# EAGLE design Serial Boy (EAGLE 9.0.0)
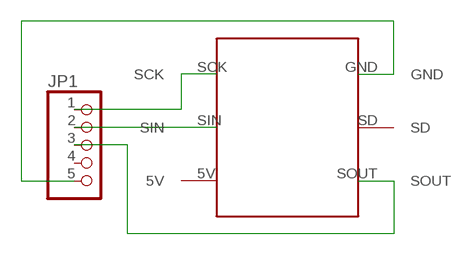
[diagram p0: schematic, sheet 1]

## Parts
JP1  PINHD-1X5/90  [1X05/90]
LNK  CARDEDGE  [CARDEDGE]

## Nets
GND: JP1.5 LNK.GND
SCK: JP1.1 LNK.SCK
SIN: JP1.2 LNK.SIN
SOUT: JP1.3 LNK.SOUT
Unconnected: JP1.4 LNK.5V LNK.SD

## Library data of the parts
JP1 = pinhead:PINHD-1X5: PIN HEADER
LNK = Card Edge:CARDEDGE

## Board
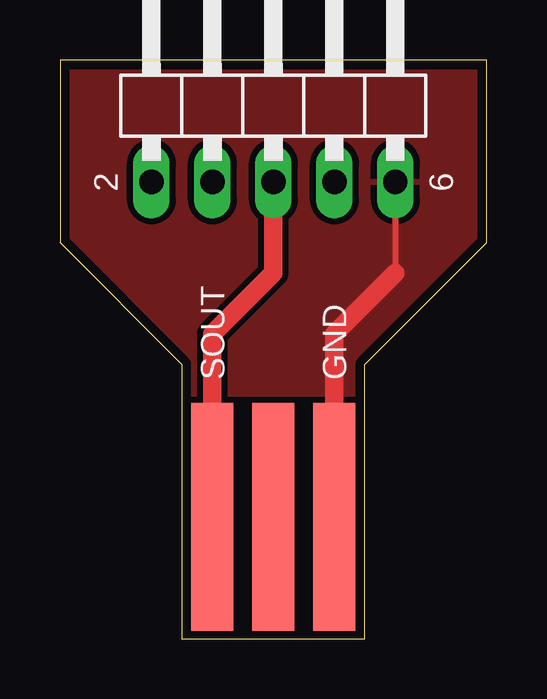
[diagram p1: board, top side]
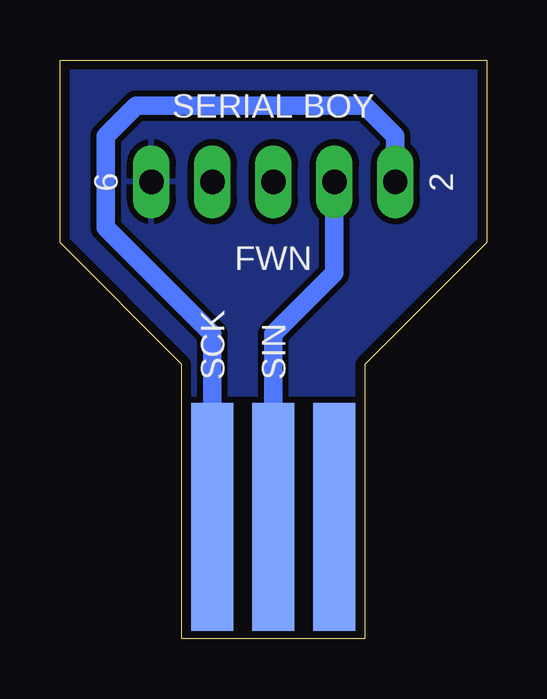
[diagram p2: board, bottom side, seen from below]

Size 17.78 x 24.13 mm. Coordinates in mm from the lower left corner, seen from the top.
Outline: 5.08,0 12.7,0 12.7,11.43 17.78,16.51 17.78,24.13 0,24.13 0,16.51 5.08,11.43 5.08,0
Copper layers (1*16): Top 0.035mm / dielectric 1.5mm / Bottom 0.035mm
Design rules "default *": minimum track width 6mil, minimum drill 0.35mm, track to track 10mil, track to pad 10mil, pad to pad 10mil, via to via 10mil, smd to smd 10mil, copper to edge 15mil, drill to drill 6mil, minimum pad ring 10mil, minimum via ring 8mil, stop-mask expansion 4mil, vias tented up to drill 0mil, thermal gap 10mil

### Footprints (pad centres in the part's own frame; a part is rotated, then mirrored left to right if it is on the bottom)
1X05/90 = drill 1.016 long: 1 -5.08,-3.81; 2 -2.54,-3.81; 3 0,-3.81; 4 2.54,-3.81; 5 5.08,-3.81
CARDEDGE = smd 1.746 x 9.492 bottom: 5V 2.54,0; SCK -2.54,0; SIN 0,0 | smd 1.746 x 9.492: GND -2.54,0; SD 0,0; SOUT 2.54,0

### Placement (x,y rotation side)
JP1  8.89,22.86 0 top
LNK  8.89,5.08 180 top

### Tracks (layer width: path | path; a pad name or v marks a point on that pad's centre or on a via)
GND
  Top 0.254: JP1.5 13.97,15.24
  Top 0.762: 13.97,15.24 11.43,12.7 LNK.GND
  pour Top: -1.27,25.4 19.05,25.4 19.05,16.51 12.7,10.16 5.08,10.16 -1.27,16.51
  pour Bottom: -1.27,25.4 19.05,25.4 19.05,16.51 12.7,10.16 5.08,10.16 -1.27,16.51
SCK
  Bottom 0.762: JP1.1 3.81,20.95 5.08,22.23 14.61,22.23 15.88,20.95 15.88,17.14 11.43,12.7 LNK.SCK
SIN
  Bottom 0.762: JP1.2 6.35,15.24 8.89,12.7 LNK.SIN
SOUT
  Top 0.762: JP1.3 8.89,15.24 6.35,12.7 LNK.SOUT

### Text on the board
tNames: 2 | 6 | SOUT | GND
bNames: SERIAL BOY | 2 | 6 | FWN | SIN | SCK